# Altium schematic sheet DM1095_Project_Information.SchDoc: =project_title
size Tabloid; CompanyName: Luxonis Holding; Organization: Luxonis Holding; Address1: 1925 Harmony Park Drive; Address2: Westminster, CO; Address3: 80234; Address4: United States; SheetNumber: 1; SheetTotal: 9
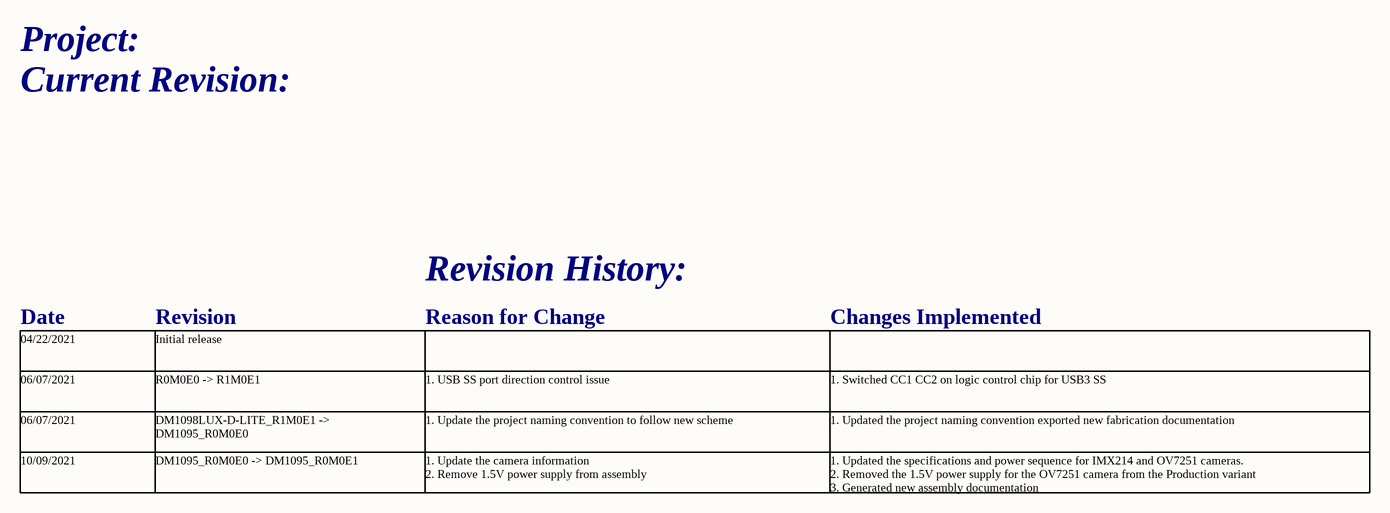
[diagram p0: DM1095_Project_Information.SchDoc]

## Notes on the sheet
- Project:
- Current Revision:
- Revision History:
- 04/22/2021
- Date
- Initial release
- Revision
- Reason for Change
- Changes Implemented
- 06/07/2021
- R0M0E0 -> R1M0E1
- DM1098LUX-D-LITE_R1M0E1 -> DM1095_R0M0E0
- 1. USB SS port direction control issue
- 1. Update the project naming convention to follow new scheme
- 1. Switched CC1 CC2 on logic control chip for USB3 SS
- 1. Updated the project naming convention exported new fabrication documentation
- 10/09/2021
- DM1095_R0M0E0 -> DM1095_R0M0E1
- 1. Update the camera information
  2. Remove 1.5V power supply from assembly
- 1. Updated the specifications and power sequence for IMX214 and OV7251 cameras.
  2. Removed the 1.5V power supply for the OV7251 camera from the Production variant
  3. Generated new assembly documentation
- Title
- Size:
- Date:
- Tabloid
- Number:
- Time:
- Revision:
- Sheet
- of
- Drawn by: